# EAGLE design FDL-3 TRG (EAGLE 9.1.0)
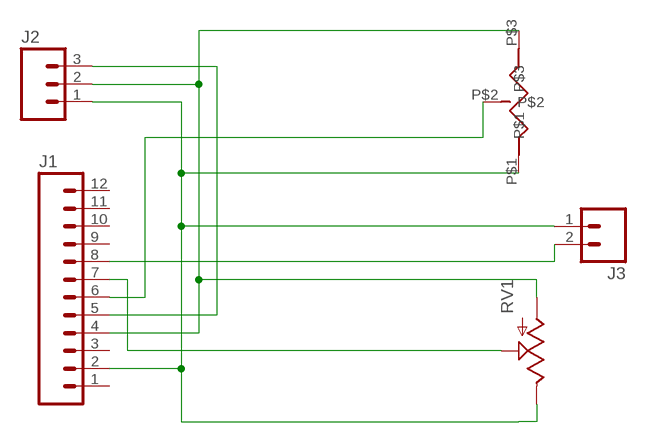
[diagram p0: schematic, sheet 1]

## Parts
J1  M12LONGPADS  [1X12_LONGPADS]
J2  M03LONGPADS  [1X03_LONGPADS]
J3  M02PTH3  [1X02_LONGPADS]
RV1  POTTRIM  [TRIM_POT]
U$1  THRUHOLEPOT  [THRUHOLEPOT]

## Nets
N$1: J1.2 J2.1 J3.1 RV1.2(E) U$1.P$1
N$2: J1.4 J2.2 RV1.3(A) U$1.P$3
N$4: J1.5 J2.3
N$5: J1.6 U$1.P$2
N$6: J1.7 RV1.1(S)
N$7: J1.8 J3.2
Unconnected: J1.1 J1.3 J1.9 J1.10 J1.11 J1.12

## Library data of the parts
J1 = SparkFun-Connectors:M12: Header 12 Standard 12-pin 0.1" header. Use with straight break away headers (SKU : PRT-00116), right angle break away headers (PRT-00553), swiss pins (PRT-00743), machine pins (PRT-00117), and female headers (PRT-00115).
J2 = SparkFun-Connectors:M03: Header 3 Standard 3-pin 0.1" header. Use with straight break away headers (SKU : PRT-00116), right angle break away headers (PRT-00553), swiss pins (PRT-00743), machine pins (PRT-00117), and female headers (PRT-00115). Molex polarized connector foot print use with SKU : PRT-08232 with associated crimp pins and housings.
J3 = SparkFun-Connectors:M02: Standard 2-pin 0.1" header. Use with - straight break away headers ( PRT-00116) - right angle break away headers (PRT-00553) - swiss pins (PRT-00743) - machine pins (PRT-00117) - female headers (PRT-00115) Molex polarized connector foot print use with: PRT-08233 with associated crimp pins and housings. 2.54_SCREWTERM for use with PRT-10571. 3.5mm Screw Terminal footprints for PRT-08084 5mm Screw Terminal footprints for use with PRT-08432
RV1 = SparkFun-Electromechanical:POT
U$1 = CustomPot:THRUHOLEPOT

## Board
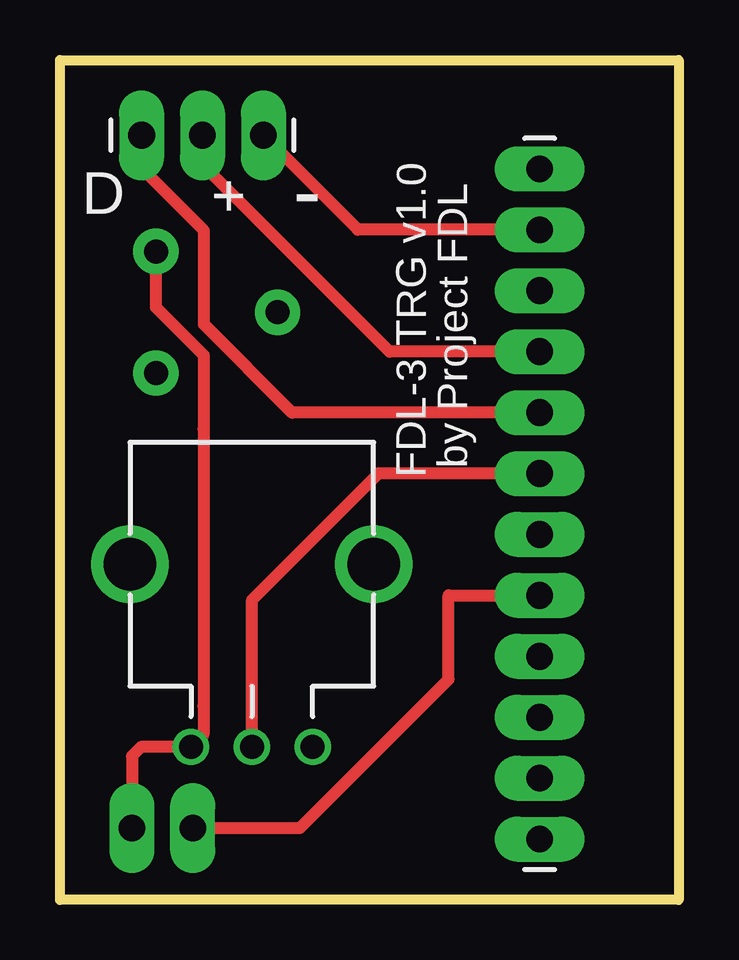
[diagram p1: board, top side]
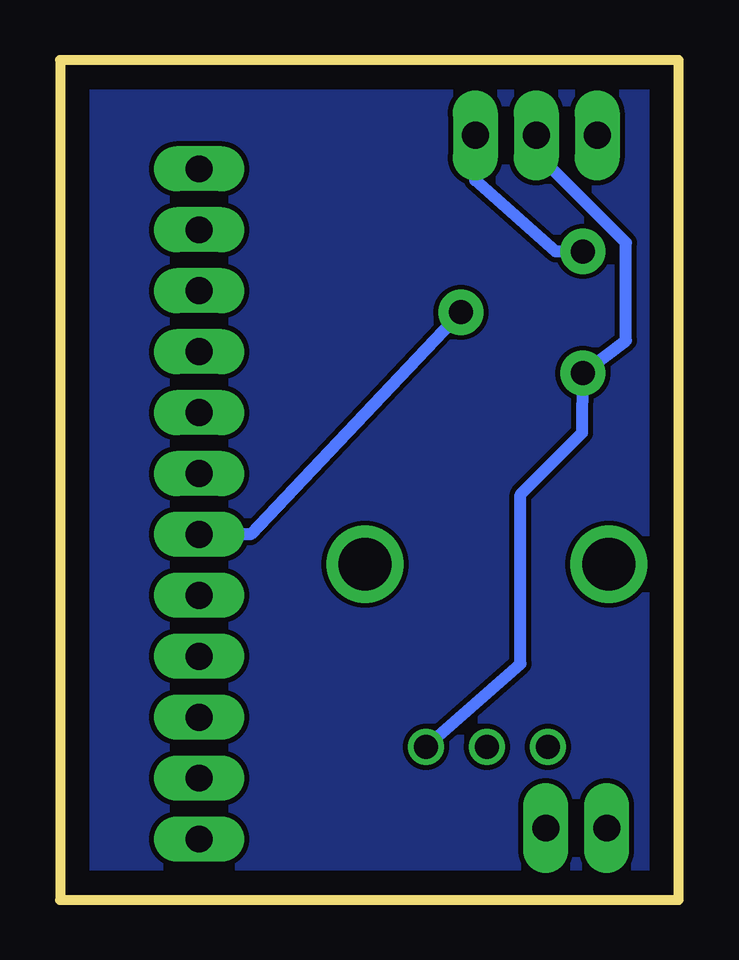
[diagram p2: board, bottom side, seen from below]

Size 25.8 x 35.02 mm. Coordinates in mm from the lower left corner, seen from the top.
Outline: 0,0 0,35.02 25.8,35.02 25.8,0 0,0
Copper layers (1*16): Top 0.035mm / dielectric 1.5mm / Bottom 0.035mm
Design rules "default": minimum track width 10mil, minimum drill 24mil, track to track 8mil, track to pad 8mil, pad to pad 8mil, via to via 8mil, smd to smd 8mil, copper to edge 40mil, drill to drill 8mil, minimum pad ring 10mil, minimum via ring 8mil, stop-mask expansion 4mil, vias tented up to drill 0mil, thermal gap 10mil

### Footprints (pad centres in the part's own frame; a part is rotated, then mirrored left to right if it is on the bottom)
1X12_LONGPADS = drill 1.118 pad 1.88 long: 1 0,0; 2 2.54,0; 3 5.08,0; 4 7.62,0; 5 10.16,0; 6 12.7,0; 7 15.24,0; 8 17.78,0; 9 20.32,0; 10 22.86,0; 11 25.4,0; 12 27.94,0
1X03_LONGPADS = drill 1.118 pad 1.88 long: 1 0,0; 2 2.54,0; 3 5.08,0
1X02_LONGPADS = drill 1.118 pad 1.88 long: 1 0,0; 2 2.54,0
TRIM_POT = drill 1 pad 1.88: 1 5.08,0; 2 0,2.54; 3 0,-2.54
THRUHOLEPOT = drill 1: P$1 -2.54,-7.62; P$2 0,-7.62; P$3 2.54,-7.62 | drill 2.2: P$4 -5.08,0; P$5 5.08,0

### Placement (x,y rotation side)
J1  20,30.48 270 top
J2  8.48,31.88 180 top
J3  3,3 0 top
RV1  4,24.5 0 top
U$1  8,14 0 top

### Tracks (layer width: path | path; a pad name or v marks a point on that pad's centre or on a via)
N$1
  Top 0.508: J1.2 12.42,27.94 J2.1 | RV1.2 4,26.52 4,24.7 6,22.7 6,19.64 5.98,19.64 5.98,8.08 5.98,6.9 U$1.P$1 3.38,6.38 3,6 J3.1
  Bottom 0.508: J2.1 8.48,30 5.13,27.04 RV1.2
N$2
  Top 0.508: J1.4 13.74,22.86 5.94,30.66 J2.2
  Bottom 0.508: J2.2 5.94,31.14 2.2,27.4 2.2,23.33 RV1.3 4.02,19.48 6.6,16.9 6.6,9.86 6.59,9.85 U$1.P$3
N$3
  pour Bottom: 0,0 25.8,0 25.8,35.02 0,35.02
N$4
  Top 0.508: J1.5 9.68,20.32 6,24 6,27.9 3.4,30.5 J2.3
N$5
  Top 0.508: U$1.P$2 8.02,12.52 13.3,17.8 19.98,17.8 J1.6
N$6
  Bottom 0.508: RV1.1 17.86,15.24 J1.7
N$7
  Top 0.508: J3.2 10,3 16.2,9.2 16.2,12.7 J1.8

### Text on the board
tPlace: D | + | - | by Project FDL
tNames: FDL-3 TRG v1.0